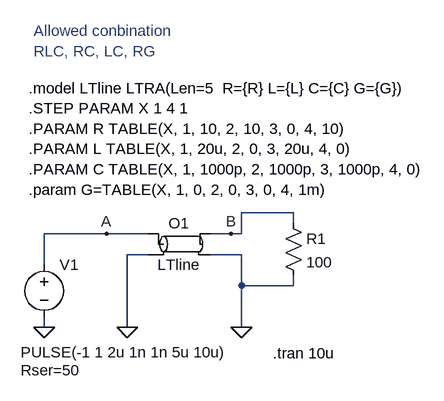
[diagram p0: schematic Fig_2-147_for-Ver-IV_LTRA-Test.asc]
Fig_2-147_for-Ver-IV_LTRA-Test.asc, the LTspice schematic file:
Version 4
SHEET 1 1232 680
WIRE 400 112 320 112
WIRE 400 128 400 112
WIRE 112 144 16 144
WIRE 176 144 112 144
WIRE 304 144 272 144
WIRE 320 144 320 112
WIRE 320 144 304 144
WIRE 176 176 144 176
WIRE 320 176 272 176
WIRE 16 192 16 144
WIRE 320 224 320 176
WIRE 400 224 400 208
WIRE 400 224 320 224
WIRE 16 288 16 272
WIRE 144 288 144 176
WIRE 320 288 320 224
FLAG 320 288 0
FLAG 144 288 0
FLAG 16 288 0
FLAG 112 144 A
FLAG 304 144 B
SYMBOL ltline 224 160 R0
SYMATTR InstName O1
SYMATTR Value LTline
SYMBOL res 384 112 R0
SYMATTR InstName R1
SYMATTR Value 100
SYMBOL voltage 16 176 R0
WINDOW 3 -36 150 Left 2
WINDOW 123 0 0 Left 2
WINDOW 39 -36 178 Left 2
SYMATTR Value PULSE(-1 1 2u 1n 1n 5u 10u)
SYMATTR SpiceLine Rser=50
SYMATTR InstName V1
TEXT 368 328 Left 2 !.tran 10u
TEXT 0 -168 Left 2 ;Allowed conbination\nRLC, RC, LC, RG
TEXT -8 -80 Left 2 !.model LTline LTRA(Len=5  R={R} L={L} C={C} G={G})\n.STEP PARAM X 1 4 1\n.PARAM R TABLE(X, 1, 10, 2, 10, 3, 0, 4, 10)\n.PARAM L TABLE(X, 1, 20u, 2, 0, 3, 20u, 4, 0)\n.PARAM C TABLE(X, 1, 1000p, 2, 1000p, 3, 1000p, 4, 0)\n.param G=TABLE(X, 1, 0, 2, 0, 3, 0, 4, 1m)

The netlist it stands for:
* Fig_2-147_for-Ver-IV_LTRA-Test.asc
O1 A 0 B 0 LTline
R1 B 0 100
V1 A 0 PULSE(-1 1 2u 1n 1n 5u 10u) Rser=50
.tran 10u
* Allowed conbination
* RLC, RC, LC, RG
.model LTline LTRA(Len=5  R={R} L={L} C={C} G={G})
.STEP PARAM X 1 4 1
.PARAM R TABLE(X, 1, 10, 2, 10, 3, 0, 4, 10)
.PARAM L TABLE(X, 1, 20u, 2, 0, 3, 20u, 4, 0)
.PARAM C TABLE(X, 1, 1000p, 2, 1000p, 3, 1000p, 4, 0)
.param G=TABLE(X, 1, 0, 2, 0, 3, 0, 4, 1m)
.backanno
.end